# Altium schematic sheet EXT_U_DET.SchDoc: =DocumentName
size A4; CompanyName: "AS Manufacturing" LLC; Organization: "AS Manufacturing" LLC; Address1: 5 Sklyarenka St.; Address2: Kyiv 04073; Address3: Ukraine; Address4: https://ajax.systems/en/; SheetNumber: 6; SheetTotal: 9; Template_version: 1.0.1
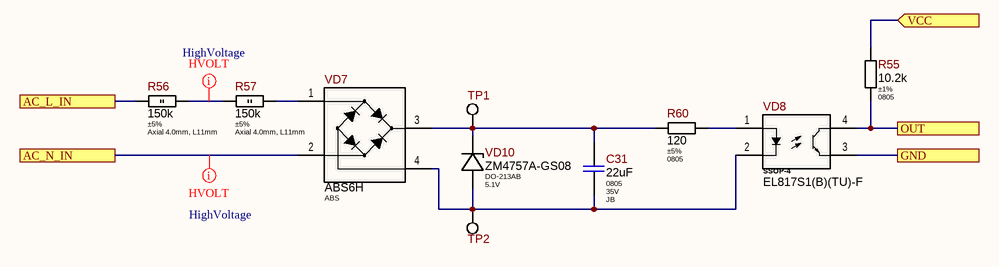
[diagram p0: EXT_U_DET.SchDoc]

## Parts
C31  Package: 0805  Voltage: 35V  Dielectric Type: JB  [CAP-0805(2012)X125T20]  (hidden comment: 22uF)
R55  Tolerance: ±1%  Package: 0805  [R_ANY_CHIP_0805_MED]  (hidden comment: 10.2k)
R56  Tolerance: ±5%  Package: Axial 4.0mm, L11mm  [MOR200S-Series]  (hidden comment: 150k)
R57  Tolerance: ±5%  Package: Axial 4.0mm, L11mm  [MOR200S-Series]  (hidden comment: 150k)
R60  Tolerance: ±5%  Package: 0805  [R_ANY_CHIP_0805_MED]  (hidden comment: 120)
TP1  PAD-0.96mm  [PAD-0.96mm]  (value not drawn)  (no BOM)
TP2  PAD-0.96mm  [PAD-0.96mm]  (value not drawn)  (no BOM)
VD7  Package: ABS  [ABSxx-Series]  (hidden comment: ABS6H)
VD8  Package: SSOP-4  [EL-817S1-(x)(xx)]  (hidden comment: EL817S1(B)(TU)-F)
VD10  Voltage: 5.1V  [DO-213AB]  (hidden comment: ZM4757A-GS08)

## Ports
AC_L_IN, AC_N_IN, GND, OUT, VCC (in)

## Nets
AC_L_IN: R56.1 ; port AC_L_IN
AC_N_IN: VD7.2 ; port AC_N_IN
GND: VD8.3(Emitter) ; port GND
OUT: R55.2 VD8.4(Collector) ; port OUT
VCC: R55.1 ; port VCC
NetC31_1: C31.1 R60.1 TP1.1 VD7.3(+) VD10.CA
NetC31_2: C31.2 TP2.1 VD7.4(-) VD8.2(Cathode) VD10.AN
NetR56_2: R56.2 R57.1
NetR57_2: R57.2 VD7.1
NetR60_2: R60.2 VD8.1(Anode)

## Layout directives
net class HighVoltage: AC_N_IN, NetR56_2

## Notes on the sheet
- Title
- Product:
- Project:
- Size:
- Date:
- Variant:
- A4
- Authors:
- Time:
- Sheet
- of
- Revision:
- @Vitech_ua
- Commit:

## Library data of the parts
C31 = C2012JB1V226M125AC: 22uF 35V JB ±20% 0805 Ceramic Capacitor RoHS; Manufacturer: TDK Corporation; Ajax_1C_ID: 32073; Ajax_1C_PN: 22uF 35V 20% 0805 TDK C2012JB1V226M125AC Ceramic Capacitors RoHS; Ajax_1С_Status: RND Only; Standard Lead Time: 30 Weeks; Component Status: Released; Replacement: NONE; GUID_1C: 562d6396-e930-11eb-ab74-0050569f2651; Value: 22uF; Part Number: C2012JB1V226M125AC; Part Type: Ceramic / JB / 0805; Component Type: SMD; Temperature Range: -25°C ~ 85°C; Tolerance: ±20%; ComponentLink1URL: https://product.tdk.com/info/en/catalog/datasheets/mlcc_commercial_general_en.pdf; Supplier 1: Mouser; Supplier Part Number 1: 810-C2012JB1V226M12C; Price: 0,567; ComponentLink1Description: Datasheet
R55 = RC0805FR-0710K2L: 10.2 kOhms ±1%, 1/8W 0805 Thick Film Resistor; Manufacturer: Yageo; Ajax_1C_ID: 13943; Ajax_1C_PN: 10.2k 1% 0805 Resistors SMD RoHS; Ajax_1С_Status: Mass Production; Power Rating: 0.125W; Voltage: 150V; Component Status: Released; Temperature Stability: ±100ppm/°C; Replacement: NONE; GUID_1C: 8bc9d0ce-c58a-11e8-ab47-0050569f2651; Value: 10.2k; Part Number: RC0805FR-0710K2L; Component Type: SMD; Part Type: Thick Film; Temperature Range: -55°C ~ 155°C; ComponentLink1URL: https://eu.mouser.com/datasheet/2/447/PYu_RC_Group_51_RoHS_L_10-1664068.pdf; Supplier 1: Digi-Key; Supplier Part Number 1: 311-10.2KCRTR-ND; Price: 0,0014; ComponentLink1Description: Datasheet
R56 R57 = MOR200SJTB-10R: 150k Ohm ±5%, 2W d4.0mm L11mm Axial Through Hole, Metal Oxide Resistor, Al2O3; Manufacturer: Hitano; Ajax_1C_ID: 17914; Ajax_1C_PN: 150k 5% 2W (MOR200SJTB-10R-Hitano) резистор выводной pcs; Ajax_1С_Status: RND Only; Voltage: 500V; Component Status: Released; Temperature Stability: ±250ppm/°C; Replacement: NONE; GUID_1C: 857e103f-078d-11ea-ab58-0050569f2651; Value: 150k; Part Number: MOR200SJTB-10R; Component Type: PTH; Part Type: Metal Oxide Film; Power Rating: 2W; Temperature Range: -55°C ~ 200°C; ComponentLink1URL: \\altiumdb.ajax.local\files\Datasheet\Passive\MOR_20160329.pdf; Supplier 1: RKS; Supplier Part Number 1: 13878; Price: 0,05250406; ComponentLink1Description: Datasheet
R60 = ERJ-P06J121V: 120 Ohms ±5%, 1/2W 0805 Thick Film Resistor; Manufacturer: Yageo; Ajax_1C_ID: 19445; Ajax_1C_PN: 120R 5% 1/2W 0805 ERJ-P06J121V Panasonic Resistors SMD RoHS; Ajax_1С_Status: Mass Production; Power Rating: 0.5W; Voltage: 400V; Component Status: Released; Temperature Stability: ±200ppm/°C; Replacement: NONE; GUID_1C: e6cc71c1-57d9-11ea-ab5b-0050569f2651; Value: 120; Part Number: ERJ-P06J121V; Component Type: SMD; Part Type: Thick Film / Anti-Surge/Pulse Withstanding; Temperature Range: -55°C ~ 155°C; ComponentLink1URL: https://industrial.panasonic.com/cdbs/www-data/pdf/RDO0000/AOA0000C331.pdf; Supplier 1: Digi-Key; Supplier Part Number 1: P120ADTR-ND; Price: 0,02100084; ComponentLink1Description: Datasheet
TP1 TP2 = PAD-0.96mm: 0.96mm Pad for Plug-In or Receptacle; Ajax_1C_PN: NONE; Ajax_1С_Status: RND Only; Component Status: Released; Part Number: PAD-0.96mm; Component Type: PTH; Manufacturer: NONE; Part Type: Pad; Temperature Range: NONE; ComponentLink1URL: NONE; Replacement: NONE; Price: NONE; ComponentLink1Description: Datasheet
VD7 = ABS6H: 1A, 600V Standard Bridge Rectifier, ABS Package; Manufacturer: Taiwan Semiconductor; Ajax_1C_ID: 34652; Ajax_1C_PN: ABS6H 600V 1A Bridge Rectifier LGE ABS; Ajax_1С_Status: RND Only; Component Status: Released; Vf: 0.95V @ 0.4A; Replacement: NONE; GUID_1C: 734c9af7-1f64-11ec-ab76-0050569f2651; Part Number: ABS6H; Part Type: Array; Component Type: SMD; Marking: ABS6H; Current: 1A; Voltage: 600V; Temperature Range: -55°C ~ 150°C; ComponentLink1URL: \\altiumdb.ajax.local\files\Datasheet\Diodes\ABS2 SERIES_M2103.pdf; Supplier 1: Mouser; Supplier Part Number 1: 821-ABS6H; Price: 0,0254; ComponentLink1Description: Datasheet
VD8 = EL817S1(B)(TU)-F: 1-Channel Photocoupler, 5kV, 130-260% CTR, SSOP-4; Manufacturer: Everlight Electronics; Ajax_1C_ID: 34526; Ajax_1C_PN: EL817S1(B)(TU)-F Optocoupler IC Everlight SMD-4; Ajax_1С_Status: RND Only; Component Status: On Review; Wavelength: NONE; GUID_1C: 2965953f-1c55-11ec-ab76-0050569f2651; ComponentLink1URL: \\altiumdb.ajax.local\files\Datasheet\Opto\el817-Everlight.pdf; ComponentLink1Description: Datasheet; Part Number: EL817S1(B)(TU)-F; Part Type: Optocoupler; Component Type: SMD; Color: NONE; Temperature Range: -55°C ~ 110°C; Supplier 1: Arrow; Supplier Part Number 1: EL817S1(B)(TU)-F; Replacement: NONE; Price: 0,04209091
VD10 = ZM4757A-GS08: Zener Diode 5.1V, 1W, ±5%, 5uA Reverse Current, DO-213AB; Manufacturer: Vishay Semiconductor; Ajax_1C_ID: 43362; Ajax_1C_PN: ZM4757A-GS08 стабилитрон 2,6*5,2 51V 1W; Ajax_1С_Status: Mass Production; Component Status: Released; Standard Lead Time: 27 Weeks; Replacement: NONE; GUID_1C: ea8fe24c-db72-11ec-a361-005056994834; Part Number: ZM4757A-GS08; Package: DO-213AB; Part Type: Zener; Component Type: SMD; Temperature Range: -65°C ~ 175°C; ComponentLink1URL: https://eu.mouser.com/datasheet/2/427/zm4728a-1767906.pdf; Supplier 1: Mouser; Supplier Part Number 1: 625-ZM4757A; Price: 0,07370924; ComponentLink1Description: Datasheet